# Altium schematic sheet RJ45.SchDoc
size A4
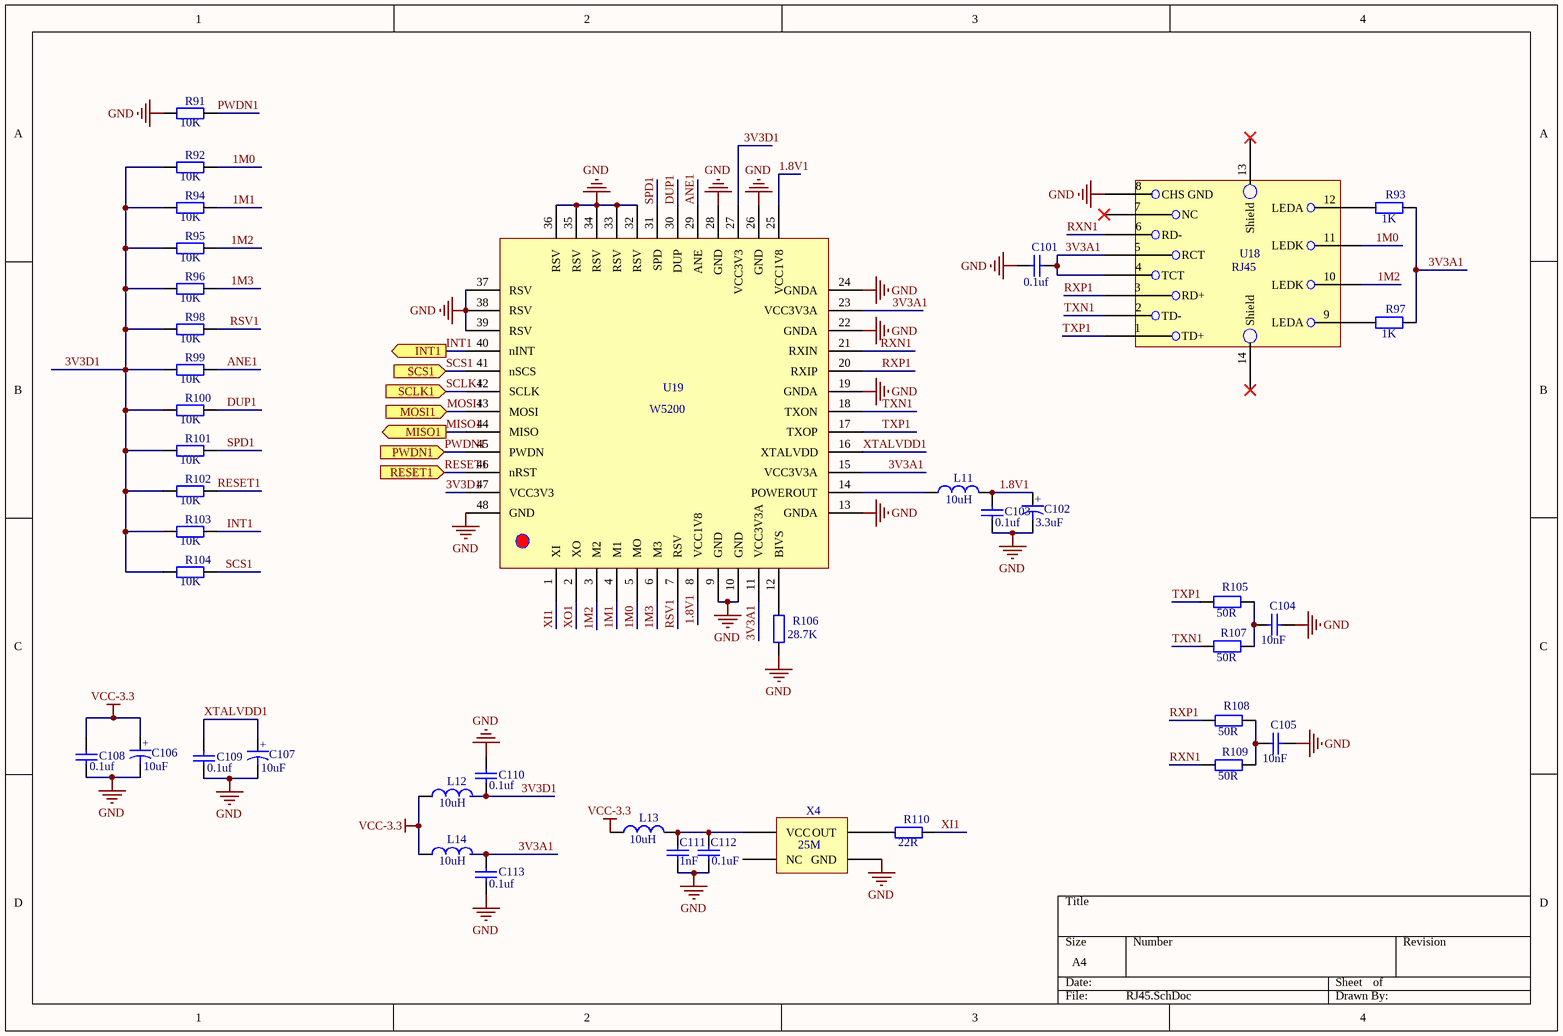
[diagram p0: RJ45.SchDoc]

## Parts
C101  value 0.1uf  [0603]  (hidden comment: Capacitor-0603)
C102  value 3.3uF  [钽电容1206（A3216）]  (hidden comment: 电解电容)
C103  value 0.1uf  [0603]  (hidden comment: Capacitor-0603)
C104  value 10nF  [0603]  (hidden comment: Capacitor-0603)
C105  value 10nF  [0603]  (hidden comment: Capacitor-0603)
C106  value 10uF  [钽电容1206（A3216）]  (hidden comment: 电解电容)
C107  value 10uF  [钽电容1206（A3216）]  (hidden comment: 电解电容)
C108  value 0.1uf  [0603]  (hidden comment: Capacitor-0603)
C109  value 0.1uf  [0603]  (hidden comment: Capacitor-0603)
C110  value 0.1uf  [0603]  (hidden comment: Capacitor-0603)
C111  value 1nF  [0603]  (hidden comment: Capacitor-0603)
C112  value 0.1uF  [0603]  (hidden comment: Capacitor-0603)
C113  value 0.1uf  [0603]  (hidden comment: Capacitor-0603)
L11  value 10uH  [0805]  (hidden comment: Inductor)
L12  value 10uH  [0805]  (hidden comment: Inductor)
L13  value 10uH  [0805]  (hidden comment: Inductor)
L14  value 10uH  [0805]  (hidden comment: Inductor)
R91  value 10K  [0603]  (hidden comment: Resistor-0603)
R92  value 10K  [0603]  (hidden comment: Resistor-0603)
R93  value 1K  [0603]  (hidden comment: Resistor-0603)
R94  value 10K  [0603]  (hidden comment: Resistor-0603)
R95  value 10K  [0603]  (hidden comment: Resistor-0603)
R96  value 10K  [0603]  (hidden comment: Resistor-0603)
R97  value 1K  [0603]  (hidden comment: Resistor-0603)
R98  value 10K  [0603]  (hidden comment: Resistor-0603)
R99  value 10K  [0603]  (hidden comment: Resistor-0603)
R100  value 10K  [0603]  (hidden comment: Resistor-0603)
R101  value 10K  [0603]  (hidden comment: Resistor-0603)
R102  value 10K  [0603]  (hidden comment: Resistor-0603)
R103  value 10K  [0603]  (hidden comment: Resistor-0603)
R104  value 10K  [0603]  (hidden comment: Resistor-0603)
R105  value 50R  [0603]  (hidden comment: Resistor-0603)
R106  value 28.7K  [0603]  (hidden comment: Resistor-0603)
R107  value 50R  [0603]  (hidden comment: Resistor-0603)
R108  value 50R  [0603]  (hidden comment: Resistor-0603)
R109  value 50R  [0603]  (hidden comment: Resistor-0603)
R110  value 22R  [0603]  (hidden comment: Resistor-0603)
U18  RJ45  [RJ45]
U19  Name: W5200  [W5200-Chip]  (hidden comment: W5200-Chip)
X4  value 25M  [有源晶振7050]  (hidden comment: 有源晶振)

## Ports
INT1 (out), MISO1 (out), MOSI1 (in), PWDN1 (in), RESET1 (in), SCLK1 (in), SCS1 (in)

## Nets
GND: C101.2 C102.1 C103.1 C104.2 C105.2 C106.1 C107.1 C108.1 C109.1 C110.2 C111.2 C112.2 C113.2 R91.1 R106.1 U18.8(CHS_GND) U19.9(GND) U19.10(GND) U19.13(GNDA) U19.19(GNDA) U19.22(GNDA) U19.24(GNDA) U19.26(GND) U19.28(GND) U19.32(RSV) U19.33(RSV) U19.34(RSV) U19.35(RSV) U19.36(RSV) U19.37(RSV) U19.38(RSV) U19.39(RSV) U19.48(GND) X4.2(GND)
VCC-3.3: C106.2 C108.2 L12.1 L13.1 L14.1
1.8V1: C102.2 C103.2 L11.2 U19.8(VCC1V8) U19.25(VCC1V8)
1M0: R92.2 U18.11(LEDK) U19.5(MO)
1M1: R94.2 U19.4(M1)
1M2: R95.2 U18.10(LEDK) U19.3(M2)
1M3: R96.2 U19.6(M3)
3V3A1: C101.1 C113.1 L14.2 R93.2 R97.2 U18.4(TCT) U18.5(RCT) U19.11(VCC3V3A) U19.15(VCC3V3A) U19.23(VCC3V3A)
3V3D1: C110.1 L12.2 R92.1 R94.1 R95.1 R96.1 R98.1 R99.1 R100.1 R101.1 R102.1 R103.1 R104.1 U19.27(VCC3V3) U19.47(VCC3V3)
ANE1: R99.2 U19.29(ANE)
DUP1: R100.2 U19.30(DUP)
INT1: R103.2 U19.40(nINT) ; port INT1
MISO1: U19.44(MISO) ; port MISO1
MOSI1: U19.43(MOSI) ; port MOSI1
PWDN1: R91.2 U19.45(PWDN) ; port PWDN1
RESET1: R102.2 U19.46(nRST) ; port RESET1
RSV1: R98.2 U19.7(RSV)
RXN1: R109.1 U18.6(RD-) U19.21(RXIN)
RXP1: R108.1 U18.3(RD+) U19.20(RXIP)
SCLK1: U19.42(SCLK) ; port SCLK1
SCS1: R104.2 U19.41(nSCS) ; port SCS1
SPD1: R101.2 U19.31(SPD)
TXN1: R107.1 U18.2(TD-) U19.18(TXON)
TXP1: R105.1 U18.1(TD+) U19.17(TXOP)
XI1: R110.2 U19.1(XI)
XO1: U19.2(XO)
XTALVDD1: C107.2 C109.2 U19.16(XTALVDD)
NetC104_1: C104.1 R105.2 R107.2
NetC105_1: C105.1 R108.2 R109.2
NetC111_1: C111.1 C112.1 L13.2 X4.4(VCC)
NetL11_1: L11.1 U19.14(POWEROUT)
NetR93_1: R93.1 U18.12(LEDA)
NetR97_1: R97.1 U18.9(LEDA)
NetR106_2: R106.2 U19.12(BIVS)
NetR110_1: R110.1 X4.3(OUT)

Not connected (* = marked no-connect by the designer): U18 7(NC)* 13(Shield)* 14(Shield)*; X4 1(NC)

## Notes on the sheet
- (in symbol 电解电容) +

## Library data of the parts
U18 = RJ45: Name: RJ45